# EAGLE schematic thtV1.2 (EAGLE 7.4.0)
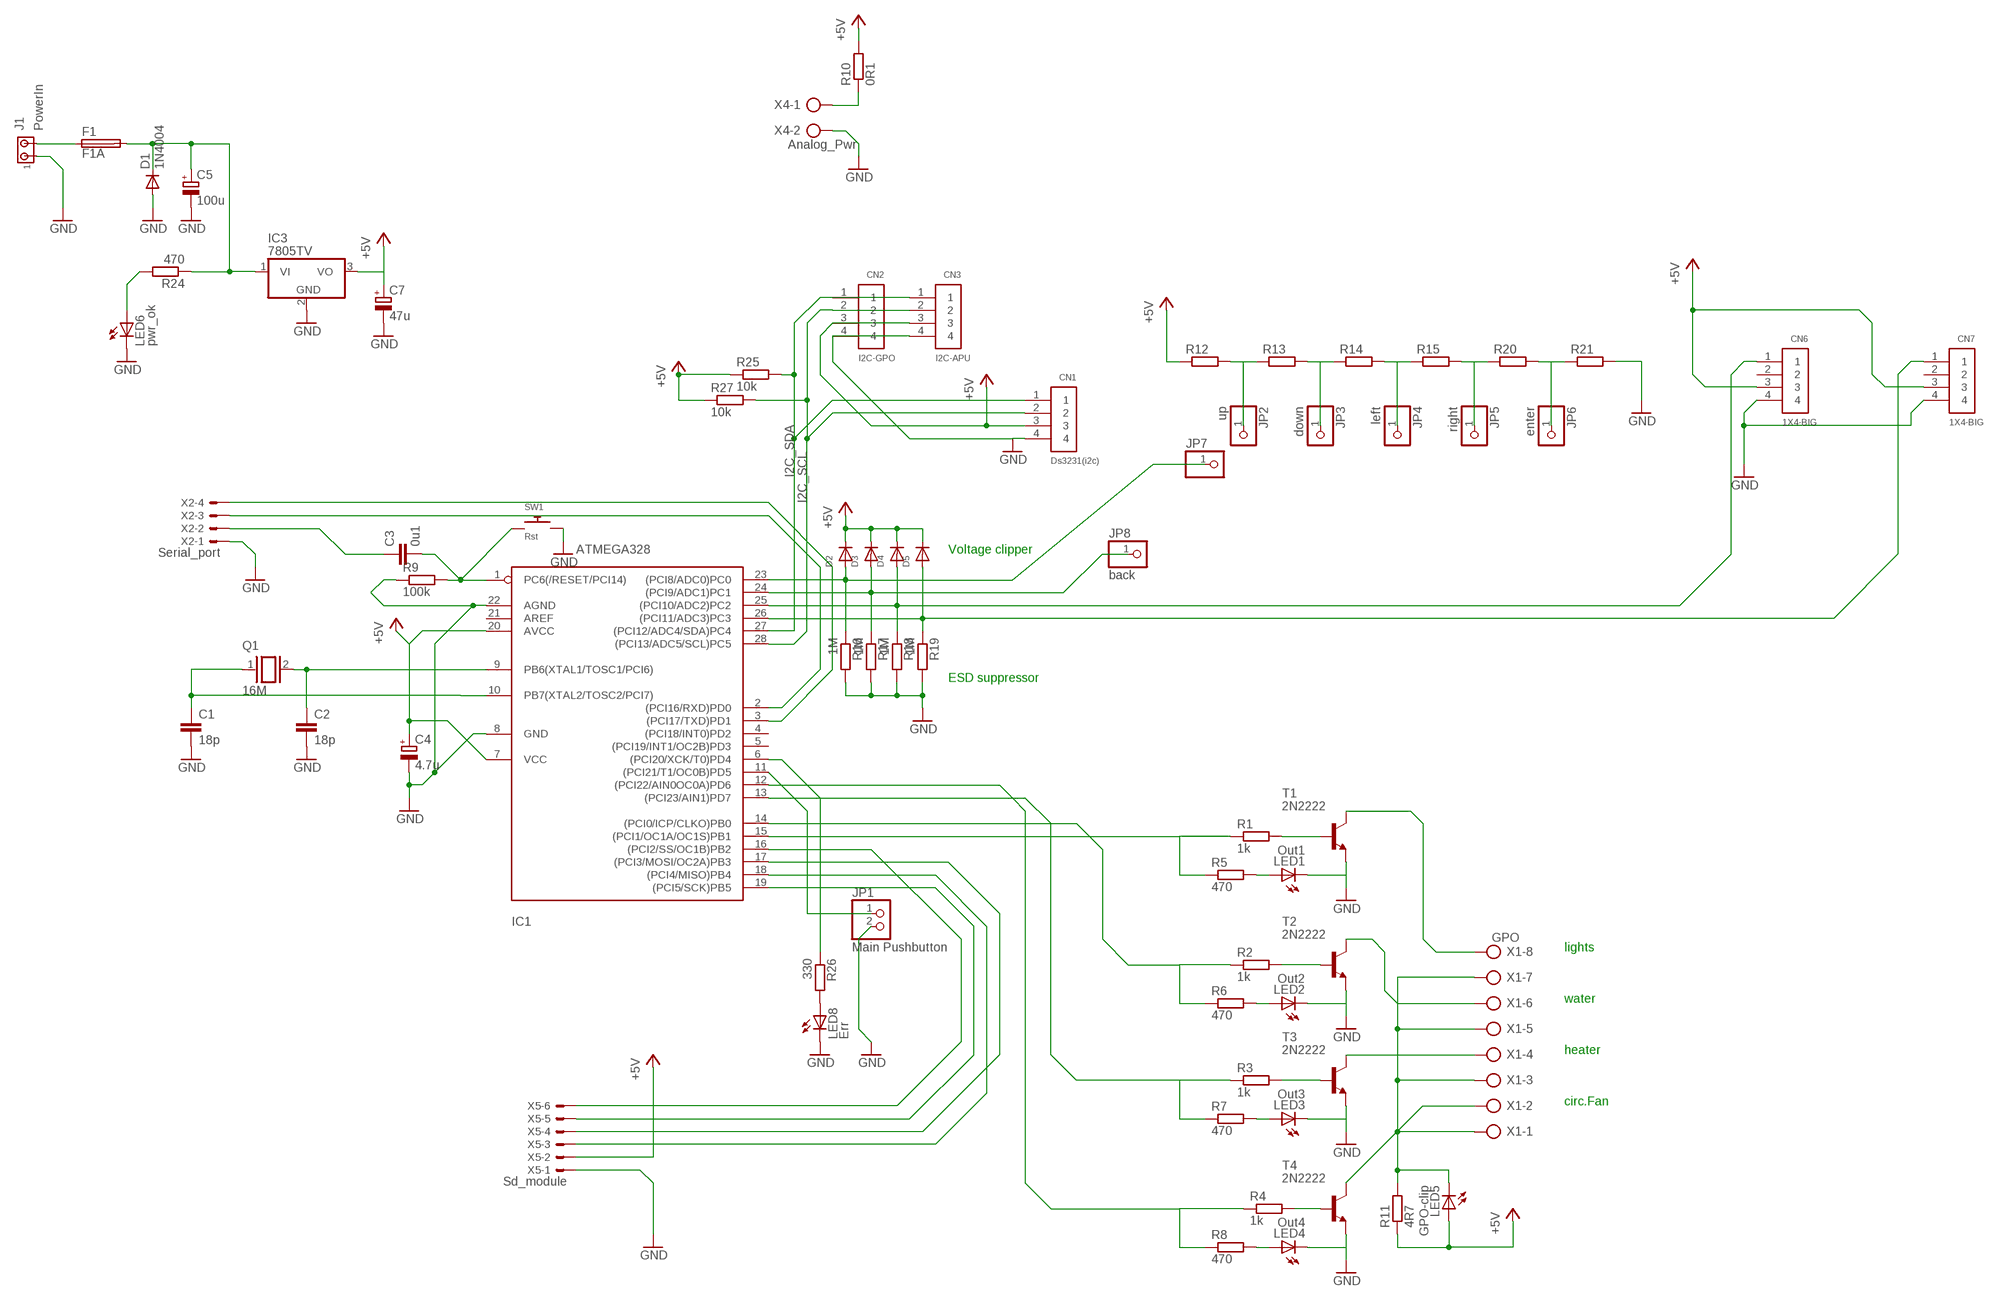
[diagram p0: schematic, sheet 1]

## Parts
C1  18p  C-EU025-024X044  [C025-024X044]
C2  18p  C-EU025-024X044  [C025-024X044]
C3  0u1  C-EU050-030X075  [C050-030X075]
C4  4.7u  CPOL-EUE5-10.5  [E5-10,5]
C5  100u  CPOL-EUE5-10.5  [E5-10,5]
C7  47u  CPOL-EUE2,5-6E  [E2,5-6E]
CN1  Ds3231(i2c)  1X4-BIG  [1X04-BIG]
CN2  I2C-GPO  1X4-BIG  [1X04-BIG]
CN3  I2C-APU  1X4-BIG  [1X04-BIG]
CN6  1X4-BIG  [1X04-BIG]
CN7  1X4-BIG  [1X04-BIG]
D1  1N4004  [DO41-10]
D2  DIODEDO-1N4148  [DO-1N4148]
D3  DIODEDO-1N4148  [DO-1N4148]
D4  DIODEDO-1N4148  [DO-1N4148]
D5  DIODEDO-1N4148  [DO-1N4148]
F1  F1A  GSH15  [GSH15]
IC1  ATMEGA328  ATMEGA168-20P  [DIL28-3]
IC3  7805TV  [TO220V]
J1  PowerIn  MTA02-156  [1X2MTA]
JP1  Main Pushbutton  PINHD-1X2  [1X02]
JP2  up  PINHD-1X1  [1X01]
JP3  down  PINHD-1X1  [1X01]
JP4  left  PINHD-1X1  [1X01]
JP5  right  PINHD-1X1  [1X01]
JP6  enter  PINHD-1X1  [1X01]
JP7  PINHD-1X1  [1X01]
JP8  back  PINHD-1X1  [1X01]
LED1  Out1  LED3MM  [LED3MM]
LED2  Out2  LED3MM  [LED3MM]
LED3  Out3  LED3MM  [LED3MM]
LED4  Out4  LED3MM  [LED3MM]
LED5  GPO-clip  LED3MM  [LED3MM]
LED6  pwr_ok  LED3MM  [LED3MM]
LED8  Err  LED3MM  [LED3MM]
Q1  16M  XTAL/S  [QS]
R1  1k  R-EU_0207/10  [0207/10]
R2  1k  R-EU_0207/10  [0207/10]
R3  1k  R-EU_0207/10  [0207/10]
R4  1k  R-EU_0207/10  [0207/10]
R5  470  R-EU_0204/2V  [0204V]
R6  470  R-EU_0204/2V  [0204V]
R7  470  R-EU_0204/2V  [0204V]
R8  470  R-EU_0204/2V  [0204V]
R9  100k  R-EU_0207/10  [0207/10]
R10  0R1  R-EU_0207/10  [0207/10]
R11  4R7  R-EU_0207/10  [0207/10]
R12  R-EU_0207/2V  [0207/2V]
R13  R-EU_0207/2V  [0207/2V]
R14  R-EU_0207/2V  [0207/2V]
R15  R-EU_0207/2V  [0207/2V]
R16  1M  R-EU_0207/10  [0207/10]
R17  1M  R-EU_0207/10  [0207/10]
R18  1M  R-EU_0207/10  [0207/10]
R19  1M  R-EU_0207/10  [0207/10]
R20  R-EU_0207/2V  [0207/2V]
R21  R-EU_0207/2V  [0207/2V]
R24  470  R-EU_0207/10  [0207/10]
R25  10k  R-EU_0204/2V  [0204V]
R26  330  R-EU_0207/2V  [0207/2V]
R27  10k  R-EU_0204/2V  [0204V]
SW1  Rst  SWITCH_PUSHBUTTONEVQ-PE  [TACT_PANA-EVQ]
T1  2N2222  [TO92-EBC-OVAL]
T2  2N2222  [TO92-EBC-OVAL]
T3  2N2222  [TO92-EBC-OVAL]
T4  2N2222  [TO92-EBC-OVAL]
X1  GPO  AK300/8  [AK300/8]
X2  Serial_port  JST-XH-04-PIN-LONG-PAD  [JST-XH-04-PACKAGE-LONG-PAD]
X4  Analog_Pwr  AK300/2  [AK300/2]
X5  Sd_module  JST-XH-06-PIN-LONG-PAD  [JST-XH-06-PACKAGE-LONG-PAD]

## Nets
+5V: C4.+ C7.+ CN1.3 CN2.3 CN3.3 CN6.3 CN7.3 D2.C D3.C D4.C D5.C IC1.7(VCC) IC1.20(AVCC) IC3.3(VO) LED5.A R10.2 R11.1 R12.1 R25.1 R27.1 X5.2
GND: C1.2 C2.2 C4.- C5.- C7.- CN1.4 CN2.4 CN3.4 CN6.4 CN7.4 D1.A IC1.8(GND) IC1.22(AGND) IC3.2(GND) J1.1 JP1.2 LED1.K(C) LED2.K(C) LED3.K(C) LED4.K(C) LED6.K(C) LED8.K(C) R9.1 R16.2 R17.2 R18.2 R19.2 R21.2 SW1.P$2 T1.E T2.E T3.E T4.E X2.1 X4.2 X5.1
I2C_SCL: CN1.2 CN2.2 CN3.2 IC1.28((PCI13/ADC5/SCL)PC5) R27.2
I2C_SDA: CN1.1 CN2.1 CN3.1 IC1.27((PCI12/ADC4/SDA)PC4) R25.2
N$1: C2.1 IC1.9(PB6(XTAL1/TOSC1/PCI6)) Q1.2
N$2: JP2.1 R12.2 R13.1
N$3: R4.2 T4.B
N$4: R3.2 T3.B
N$5: LED8.A R26.2
N$6: LED3.A R7.2
N$7: LED2.A R6.2
N$8: LED1.A R5.2
N$9: LED4.A R8.2
N$10: R1.2 T1.B
N$11: R2.2 T2.B
N$12: IC1.12((PCI22/AIN0OC0A)PD6) R4.1 R8.1
N$13: R10.1 X4.1
N$14: IC1.13((PCI23/AIN1)PD7) R3.1 R7.1
N$15: IC1.14((PCI0/ICP/CLKO)PB0) R2.1 R6.1
N$16: D3.A IC1.24((PCI9/ADC1)PC1) JP8.1 R17.1
N$17: IC1.11((PCI21/T1/OC0B)PD5) JP1.1
N$18: T3.C X1.4
N$19: C1.1 IC1.10(PB7(XTAL2/TOSC2/PCI7)) Q1.1
N$20: IC1.6((PCI20/XCK/T0)PD4) R26.1
N$21: C3.1 X2.2
N$22: IC1.18((PCI4/MISO)PB4) X5.3
N$23: IC1.19((PCI5/SCK)PB5) X5.5
N$24: IC1.2((PCI16/RXD)PD0) X2.3
N$25: IC1.3((PCI17/TXD)PD1) X2.4
N$26: IC1.17((PCI3/MOSI/OC2A)PB3) X5.4
N$27: F1.1 J1.2
N$28: JP3.1 R13.2 R14.1
N$29: C5.+ D1.C F1.2 IC3.1(VI) R24.1
N$30: C3.2 IC1.1(PC6(/RESET/PCI14)) R9.2 SW1.P$1
N$31: JP4.1 R14.2 R15.1
N$32: IC1.16((PCI2/SS/OC1B)PB2) X5.6
N$33: JP5.1 R15.2 R20.1
N$34: T1.C X1.8
N$35: T2.C X1.6
N$36: JP6.1 R20.2 R21.1
N$37: T4.C X1.2
N$38: LED5.K(C) R11.2 X1.1 X1.3 X1.5 X1.7
N$42: CN7.1 D5.A IC1.26((PCI11/ADC3)PC3) R19.1
N$43: D2.A IC1.23((PCI8/ADC0)PC0) JP7.1 R16.1
N$50: CN6.1 D4.A IC1.25((PCI10/ADC2)PC2) R18.1
N$52: LED6.A R24.2
N$57: IC1.15((PCI1/OC1A/OC1S)PB1) R1.1 R5.1
Unconnected: CN6.2 CN7.2 IC1.4((PCI18/INT0)PD2) IC1.5((PCI19/INT1/OC2B)PD3) IC1.21(AREF)

## Notes on the sheet
- Voltage clipper
- ESD suppressor
- lights
- water
- heater
- circ.Fan

## Library data of the parts
C1-C3 = resistor:C-EU: CAPACITOR, European symbol
C4 C5 C7 = rcl:CPOL-EU: POLARIZED CAPACITOR, European symbol
CN1-CN3 CN6 CN7 = adafruit:1X4: 4-pin connector
D1 = adafruit:1N4004: DIODE General purpose 1N400x type rectifier (With bigger pads) http://www.ladyada.net/library/pcb/eaglelibrary.html
D2-D5 = adafruit:DIODE: Diode SMADIODE - SMA Surface Mount Package 20V 1A Schottky Diode Digikey: 641-1014-6-ND DO-1N4148 - Through Hole Small Current Diode SOD-123 20V 1 A (.5mV Vf) Schottky Diode - Digikey: MBRX120TPMSCT-ND SOD-323 10V 570mA (.38mV Vf, 3ns) Schottky Diode - Digikey: ZLLS410CT-ND SOD-523 30V 30mA Schottky Diode (RB751S-40TE61) - Digikey: RB751S-40TE61CT-ND SOT23-R/W - SOT23 Package (R = Solder Paste/Reflow Ovens, W = Hand-Soldering) BAT54Film 40V 300mA - Digikey: 497-7162-1-ND
F1 = fuse:GSH15: FUSE HOLDER grid 15mm, 19649 Wickmann; MPN: 64900001039; OC_FARNELL: 1271673; OC_NEWARK: 02P0318
IC1 = adafruit:ATMEGA168*P: MICROCONTROLLER 16 kBytes FLASH 1 kBytes SRAM 512 Bytes EEPROM USART 8-channel 10 bit ADC
IC3 = linear:78*: Positive VOLTAGE REGULATOR Source: http://cache.national.com/ds/LM/LM78L05.pdf http://www.fairchildsemi.com/ds/LM/LM7805.pdf
J1 = con-amp:MTA02-156: AMP connector
JP1 = pinhead:PINHD-1X2: PIN HEADER
JP2-JP8 = adafruit:PINHD-1X1: Pin header 1x1 for 0.1" spacing With round pins
LED1-LED6 LED8 = adafruit:LED: LED OSRAM: - CHIPLED LG R971, LG N971, LY N971, LG Q971, LY Q971, LO R971, LY R971 LH N974, LH R974 LS Q976, LO Q976, LY Q976 LO Q996 - Hyper CHIPLED LW Q18S LB Q993, LB Q99A, LB R99A - SideLED LS A670, LO A670, LY A670, LG A670, LP A670 LB A673, LV A673, LT A673, LW A673 LH A674 LY A675 LS A676, LA A676, LO A676, LY A676, LW A676 LS A679, LY A679, LG A679 - Hyper Micro SIDELED® LS Y876, LA Y876, LO Y876, LY Y876 LT Y87S - SmartLED LW L88C, LW L88S LB L89C, LB L89S, LG L890 LS L89K, LO L89K, LY L89K LS L896, LA L896, LO L896, LY L896 - TOPLED LS T670, LO T670, LY T670, LG T670, LP T670 LSG T670, LSP T670, LSY T670, LOP T670, LYG T670 LG T671, LOG T671, LSG T671 LB T673, LV T673, LT T673, LW T673 LH T674 LS T676, LA T676, LO T676, LY T676, LB T676, LH T676, LSB T676, LW T676 LB T67C, LV T67C, LT T67C, LS T67K, LO T67K, LY T67K, LW E67C LS E67B, LA E67B, LO E67B, LY E67B, LB E67C, LV E67C, LT E67C LW T67C LS T679, LY T679, LG T679 LS T770, LO T770, LY T770, LG T770, LP T770 LB T773, LV T773, LT T773, LW T773 LH T774 LS E675, LA E675, LY E675, LS T675 LS T776, LA T776, LO T776, LY T776, LB T776 LHGB T686 LT T68C, LB T68C - Hyper Mini TOPLED® LB M676 - Mini TOPLED Santana® LG M470 LS M47K, LO M47K, LY M47K Source: http://www.osram.convergy.de/
Q1 = special:XTAL/S: CRYSTAL
R1-R21 R24-R27 = rcl:R-EU_: RESISTOR, European symbol
SW1 = adafruit:SWITCH_PUSHBUTTON: Buttons SOFTTOUCHSMD_SJ - Soft touch temporary push button (Super Junk Akihabara) Compatible with SKPMANE010 [Mouser: 688-SKPMAN] C&K_KSS = Digikey: KSS221GLFS
T1-T4 = adafruit:2N2222: NPN TRANSISTOR Big oval pads
X1 = con-ptr500:AK300/8: CONNECTOR; OC_FARNELL: unknown; OC_NEWARK: unknown
X2 = Rembrandt Electronics - JST XH Connectors v1-0:JST-XH-04-PIN: JST XH Connector 2 Pin Wire to board connector. Pitch: 2,54 mm, (0.100") Number of pins: 4 Created by Rembrandt Electronics www.rembrandtelectronics.com
X4 = con-ptr500:AK300/2: CONNECTOR; OC_FARNELL: unknown; OC_NEWARK: unknown
X5 = Rembrandt Electronics - JST XH Connectors v1-0:JST-XH-06-PIN: JST XH Connector 2 Pin Wire to board connector. Pitch: 2,54 mm, (0.100") Number of pins: 6 Created by Rembrandt Electronics www.rembrandtelectronics.com